# Altium schematic sheet Active_LPF_HPF_Sch.SchDoc
size A; SheetNumber: 1; SheetTotal: 1
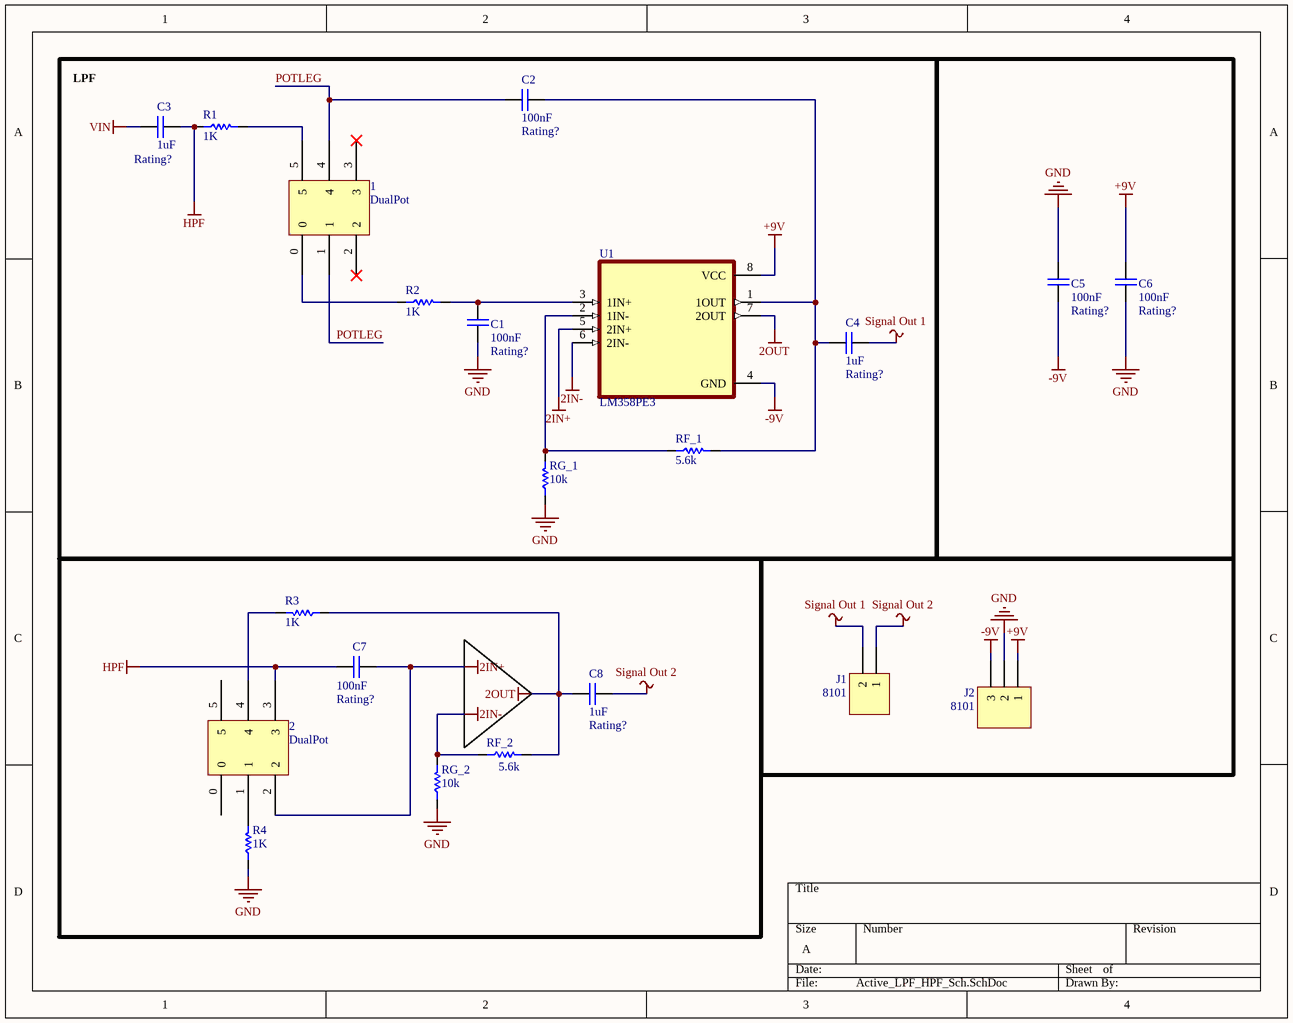
[diagram p0: Active_LPF_HPF_Sch.SchDoc]

## Parts
1  DualPot  [DualPot]
2  DualPot  [DualPot]
C1  Rating: Rating?  [Cap]  (hidden comment: 100nF)
C2  Rating: Rating?  [Cap]  (hidden comment: 100nF)
C3  Rating: Rating?  [Cap]  (hidden comment: 1uF)
C4  Rating: Rating?  [Cap]  (hidden comment: 1uF)
C5  Rating: Rating?  [Cap]  (hidden comment: 100nF)
C6  Rating: Rating?  [Cap]  (hidden comment: 100nF)
C7  Rating: Rating?  [Cap]  (hidden comment: 100nF)
C8  Rating: Rating?  [Cap]  (hidden comment: 1uF)
J1  Inflow: 8101  [HDR_THT_2F_2.54mm]  (hidden comment: 2)
J2  Inflow: 8101  [HDR_THT_3F_2.54mm]  (hidden comment: 3)
R1  1K  [Res-(1/4)]
R2  1K  [Res-(1/4)]
R3  1K  [Res-(1/4)]
R4  1K  [Res-(1/4)]
RF_1  5.6k  [Res-(1/4)]
RF_2  5.6k  [Res-(1/4)]
RG_1  10k  [Res-(1/4)]
RG_2  10k  [Res-(1/4)]
U1  LM358PE3  [DIP794W45P254L959H508Q8]

## Blocks framed on the sheet
LPF: 1 C1-C4 R1 R2 RF_1 RG_1 U1

## Nets
2IN+: 2.2 C7.2 U1.5(2IN+)
2IN-: RF_2.1 RG_2.2 U1.6(2IN-)
2OUT: C8.1 R3.1 RF_2.2 U1.7(2OUT)
+9V: C6.2 J2.1 U1.8(VCC)
-9V: C5.1 J2.3 U1.4(GND)
GND: C1.2 C5.2 C6.1 J2.2 R4.1 RG_1.1 RG_2.1
HPF: 2.3 C3.2 C7.1 R1.1
Signal Out 1: C4.2 J1.2
Signal Out 2: C8.2 J1.1
VIN: C3.1
POTLEG: 1.1 1.4 C2.1
Net1_0: 1.0 R2.1
Net1_5: 1.5 R1.2
Net2_1: 2.1 R4.2
Net2_4: 2.4 R3.2
NetC1_1: C1.1 R2.2 U1.3(1IN+)
NetC2_2: C2.2 C4.1 RF_1.2 U1.1(1OUT)
NetRF_1_1: RF_1.1 RG_1.2 U1.2(1IN-)

Not connected (* = marked no-connect by the designer): 1 2* 3*; 2 0 5

## Library data of the parts
C1-C8 = Cap_Multi_THT: Multi layer capacitor; Inflow: inflow?; Type: Type?; Validation: Valid; Package: Package?
  C1 C2 C5-C7: Value: 100nF
  C3 C4 C8: Value: 1uF
J1 = Con_FPH_2x1_V_THT_2.54: Header, single row, 2 pin; Rating: Rating?; Validation: NT; Value: 2; Package: Package?; Type: Type?
J2 = Con_FPH_3x1_V_THT_2.54: Header, single row, 3 pin; Rating: Rating?; Validation: NT; Value: 3; Package: Package?; Type: Type?
R1-R4 RF_1 RF_2 RG_1 RG_2 = Res_THT: Resistor; Inflow: inflow?; Rating: 0.25W; Validation: Valid; Package: Dip; Type: 10%
  R1-R4: Value: 1K
  RF_1 RF_2: Value: 5.6k
  RG_1 RG_2: Value: 10k
U1 = LM358PE3: Dual, 30-V, 700-kHz operational amplifier; MF: Texas Instruments; SnapEDA_Link: https://www.snapeda.com/parts/LM358PE3/Texas+Instruments/view-part/?ref=snap; Package: PDIP-8 Texas; Value: *; MP: LM358PE3; Check_prices: https://www.snapeda.com/parts/LM358PE3/Texas+Instruments/view-part/?ref=eda